# Altium schematic sheet 07 MIMXRT1170 PART3.SchDoc
size A2; ApprovedBy: DNP; CheckedBy: DNP; Author: DNP; CompanyName: Google LLC; DrawnBy: DNP; Organization: Google LLC; Address1: 1600 Amphitheatre Parkway; Address2: Mountain View, CA 94043; Address3: DNP; Address4: DNP; DocumentNumber: 7; SheetNumber: 7; SheetTotal: 17; VersionControl_RevNumber: DNP; IsUserConfigurable: DNP; Time: DNP; ImagePath: DNP; Rule: DNP; ProjectName: Enterprise; Application_BuildNumber: DNP
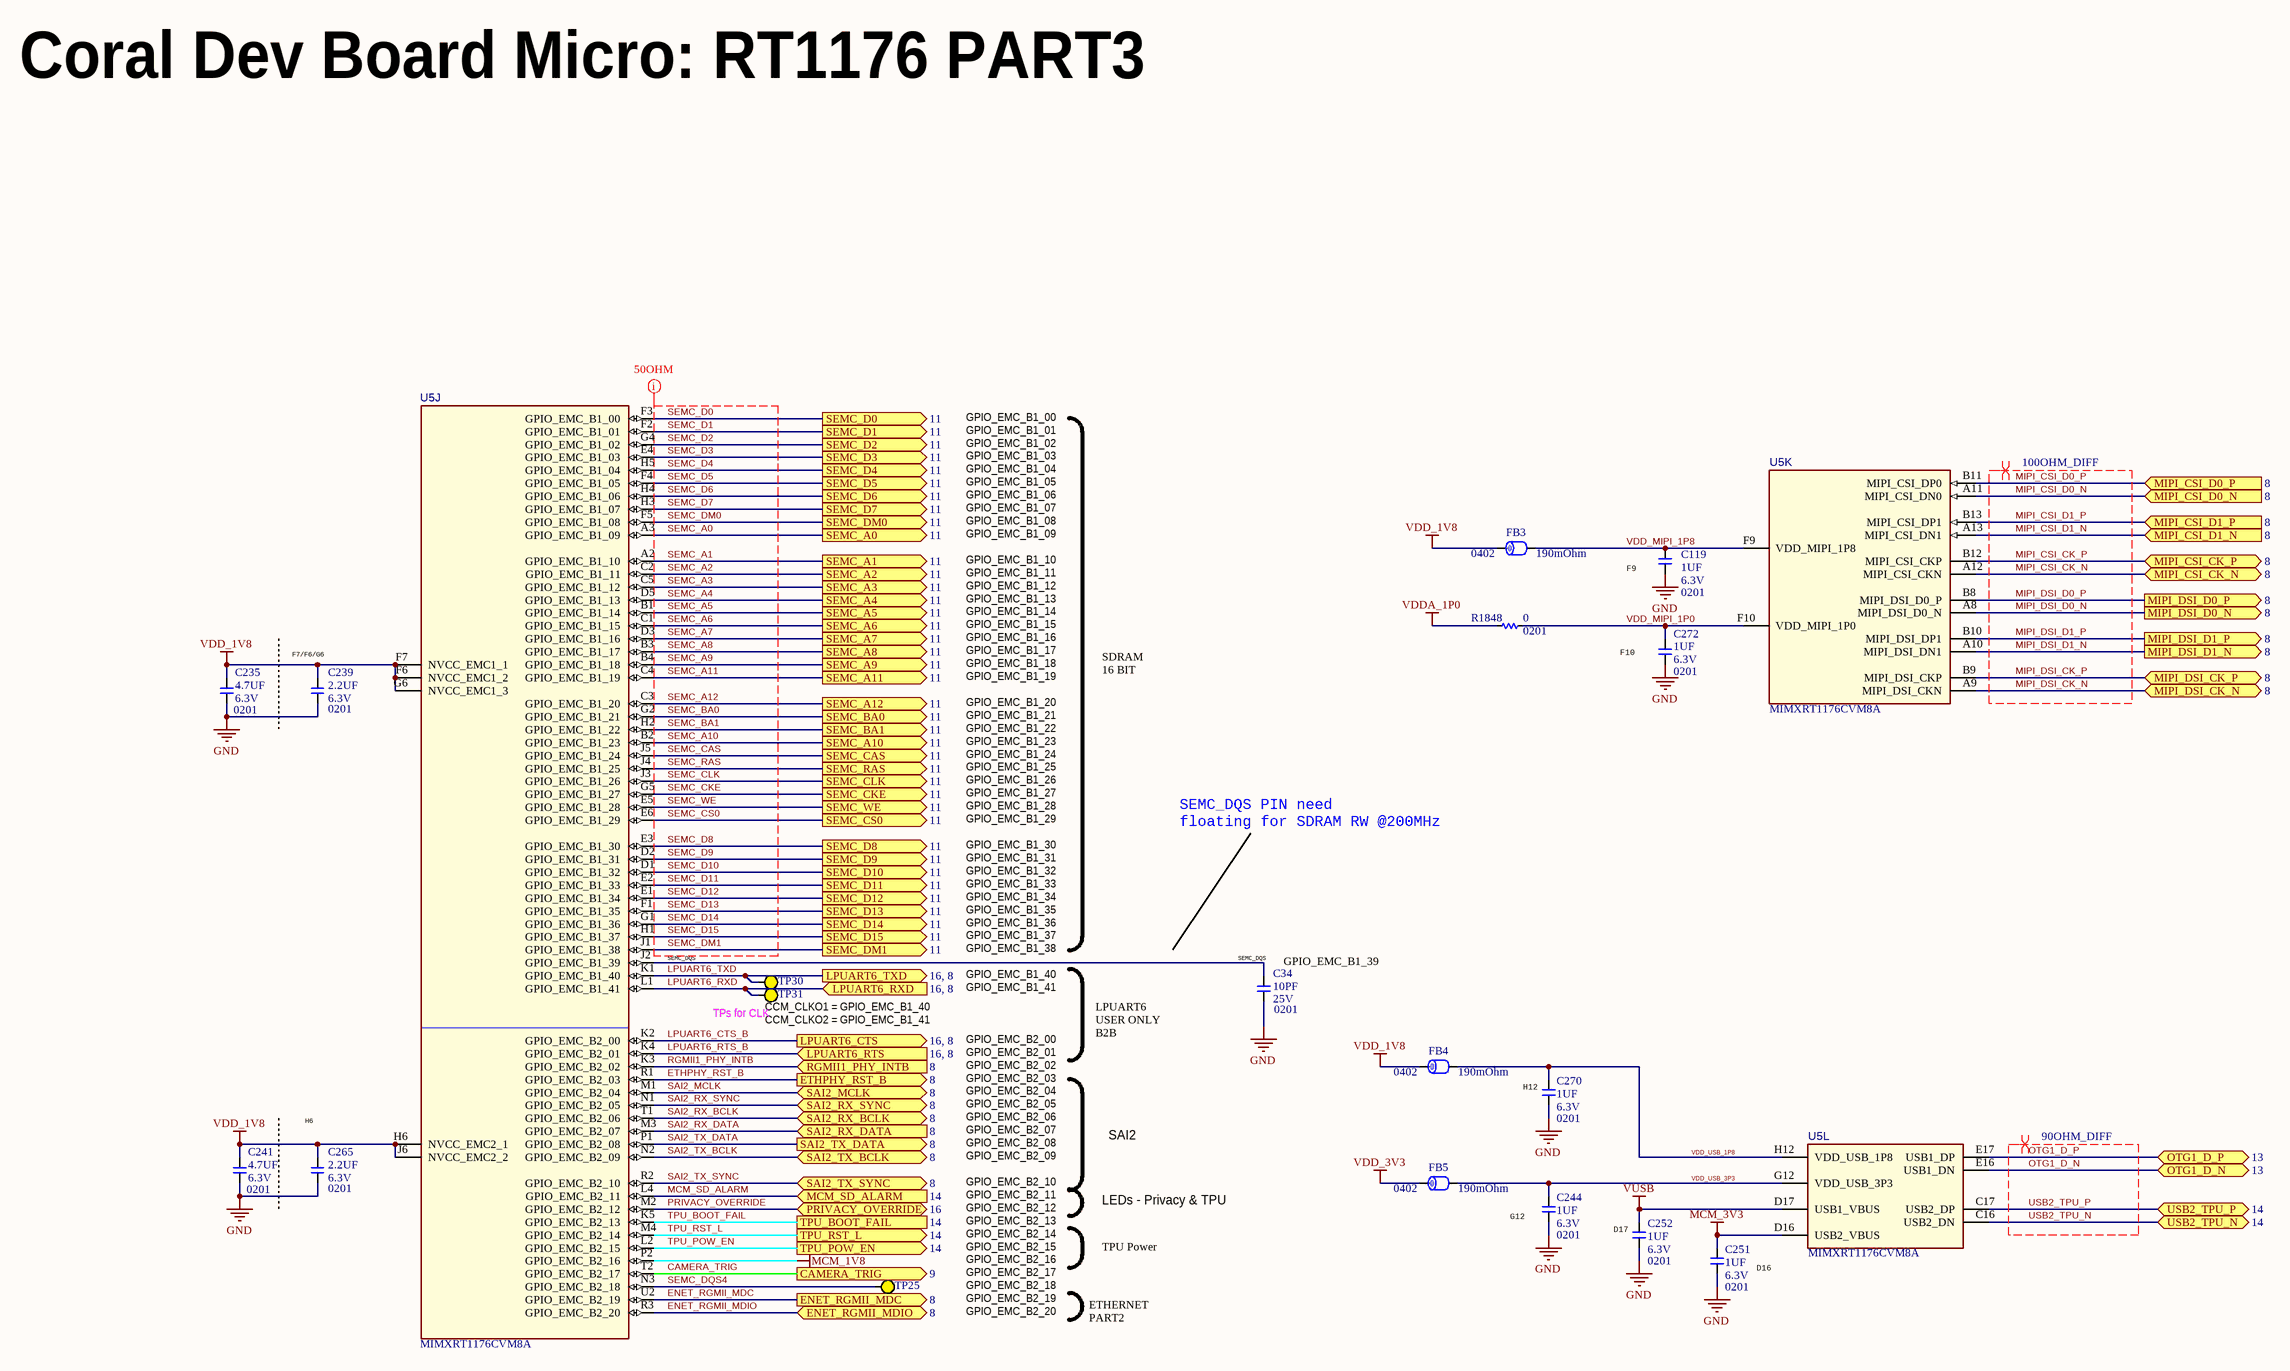
[diagram p0: 07 MIMXRT1170 PART3.SchDoc]

## Parts
C34  value 10PF  Package: 0201  Voltage: 25V  [C0201Y]  (hidden comment: __Template_Cap)
C119  value 1UF  Package: 0201  Voltage: 6.3V  [C0201_H0.39MM]  (hidden comment: __Template_Cap)
C235  value 4.7UF  Package: 0201  Voltage: 6.3V  [C0201Y]  (hidden comment: __Template_Cap)
C239  value 2.2UF  Package: 0201  Voltage: 6.3V  [C0201_H0.39MM]  (hidden comment: __Template_Cap)
C241  value 4.7UF  Package: 0201  Voltage: 6.3V  [C0201Y]  (hidden comment: __Template_Cap)
C244  value 1UF  Package: 0201  Voltage: 6.3V  [C0201_H0.39MM]  (hidden comment: __Template_Cap)
C251  value 1UF  Package: 0201  Voltage: 6.3V  [C0201_H0.39MM]  (hidden comment: __Template_Cap)
C252  value 1UF  Package: 0201  Voltage: 6.3V  [C0201_H0.39MM]  (hidden comment: __Template_Cap)
C265  value 2.2UF  Package: 0201  Voltage: 6.3V  [C0201_H0.39MM]  (hidden comment: __Template_Cap)
C270  value 1UF  Package: 0201  Voltage: 6.3V  [C0201_H0.39MM]  (hidden comment: __Template_Cap)
C272  value 1UF  Package: 0201  Voltage: 6.3V  [C0201_H0.39MM]  (hidden comment: __Template_Cap)
FB3  Package: 0402  Rdc max: 190mOhm  [L0402_H0.55MM]  (hidden comment: __Template_Ferrite_Bead)
FB4  Package: 0402  Rdc max: 190mOhm  [L0402_H0.55MM]  (hidden comment: __Template_Ferrite_Bead)
FB5  Package: 0402  Rdc max: 190mOhm  [L0402_H0.55MM]  (hidden comment: __Template_Ferrite_Bead)
R1848  value 0  Package: 0201  [R0201]
TP25  TESTPAD_30MIL  [TESTPAD_SMT_30MIL]  (value not drawn)  (no BOM)
TP30  TESTPAD_30MIL  [TESTPAD_SMT_30MIL]  (value not drawn)  (no BOM)
TP31  TESTPAD_30MIL  [TESTPAD_SMT_30MIL]  (value not drawn)  (no BOM)
U5  MFG P/N: MIMXRT1176CVM8A  [BGA289C80P17X17_1400X14000X152]  (hidden comment: MCU_MIMXRT1176CVM8A)  (parts J,K,L of 12)

## Ports
CAMERA_TRIG (out, see 9), ENET_RGMII_MDC (out, see 8), ENET_RGMII_MDIO (bidir, see 8), ETHPHY_RST_B (out, see 8), LPUART6_CTS (out, see 16, 8), LPUART6_RTS (in, see 16, 8), LPUART6_RXD (in, see 16, 8), LPUART6_TXD (out, see 16, 8), MCM_SD_ALARM (in, see 14), MIPI_CSI_CK_N (bidir, see 8), MIPI_CSI_CK_P (bidir, see 8), MIPI_CSI_D0_N (in, see 8), MIPI_CSI_D0_P (in, see 8), MIPI_CSI_D1_N (in, see 8), MIPI_CSI_D1_P (in, see 8), MIPI_DSI_CK_N (bidir, see 8), MIPI_DSI_CK_P (bidir, see 8), MIPI_DSI_D0_N (out, see 8), MIPI_DSI_D0_P (out, see 8), MIPI_DSI_D1_N (out, see 8), MIPI_DSI_D1_P (out, see 8), OTG1_D_N (bidir, see 13), OTG1_D_P (bidir, see 13), PRIVACY_OVERRIDE (bidir, see 16), RGMII1_PHY_INTB (in, see 8), SAI2_MCLK (bidir, see 8), SAI2_RX_BCLK (bidir, see 8), SAI2_RX_DATA (in, see 8), SAI2_RX_SYNC (bidir, see 8), SAI2_TX_BCLK (bidir, see 8), SAI2_TX_DATA (out, see 8), SAI2_TX_SYNC (bidir, see 8), SEMC_A0 (out, see 11), SEMC_A1 (out, see 11), SEMC_A2 (out, see 11), SEMC_A3 (out, see 11), SEMC_A4 (out, see 11), SEMC_A5 (out, see 11), SEMC_A6 (out, see 11), SEMC_A7 (out, see 11), SEMC_A8 (out, see 11), SEMC_A9 (out, see 11), SEMC_A10 (out, see 11), SEMC_A11 (out, see 11), SEMC_A12 (out, see 11), SEMC_BA0 (out, see 11), SEMC_BA1 (out, see 11), SEMC_CAS (out, see 11), SEMC_CKE (out, see 11), SEMC_CLK (out, see 11), SEMC_CS0 (out, see 11), SEMC_D0 (out, see 11), SEMC_D1 (out, see 11), SEMC_D2 (out, see 11), SEMC_D3 (out, see 11), SEMC_D4 (out, see 11), SEMC_D5 (out, see 11), SEMC_D6 (out, see 11), SEMC_D7 (out, see 11), SEMC_D8 (out, see 11), SEMC_D9 (out, see 11), SEMC_D10 (out, see 11), SEMC_D11 (out, see 11), SEMC_D12 (out, see 11), SEMC_D13 (out, see 11), SEMC_D14 (out, see 11), SEMC_D15 (out, see 11), SEMC_DM0 (out, see 11), SEMC_DM1 (out, see 11), SEMC_RAS (out, see 11), SEMC_WE (out, see 11), TPU_BOOT_FAIL (see 14), TPU_POW_EN (out, see 14), TPU_RST_L (out, see 14), USB2_TPU_N (bidir, see 14), USB2_TPU_P (bidir, see 14)

## Nets
GND: C34.2 C119.2 C235.2 C239.2 C241.2 C244.2 C251.2 C252.2 C265.2 C270.2 C272.2
MCM_1V8: U5.P2(GPIO_EMC_B2_16)
MCM_3V3: C251.1 U5.D16(USB2_VBUS)
VDD_1V8: C235.1 C239.1 C241.1 C265.1 FB3.1 FB4.1 U5.F6(NVCC_EMC1_2) U5.F7(NVCC_EMC1_1) U5.G6(NVCC_EMC1_3) U5.H6(NVCC_EMC2_1) U5.J6(NVCC_EMC2_2)
VDD_3V3: FB5.1
VDDA_1P0: R1848.1
VUSB: C252.1 U5.D17(USB1_VBUS)
CAMERA_TRIG: U5.T2(GPIO_EMC_B2_17) ; port CAMERA_TRIG
ENET_RGMII_MDC: U5.U2(GPIO_EMC_B2_19) ; port ENET_RGMII_MDC
ENET_RGMII_MDIO: U5.R3(GPIO_EMC_B2_20) ; port ENET_RGMII_MDIO
ETHPHY_RST_B: U5.R1(GPIO_EMC_B2_03) ; port ETHPHY_RST_B
LPUART6_CTS_B: U5.K2(GPIO_EMC_B2_00) ; port LPUART6_CTS
LPUART6_RTS_B: U5.K4(GPIO_EMC_B2_01) ; port LPUART6_RTS
LPUART6_RXD: TP31.1 U5.L1(GPIO_EMC_B1_41) ; port LPUART6_RXD
LPUART6_TXD: TP30.1 U5.K1(GPIO_EMC_B1_40) ; port LPUART6_TXD
MCM_SD_ALARM: U5.L4(GPIO_EMC_B2_11) ; port MCM_SD_ALARM
MIPI_CSI_CK_N: U5.A12(MIPI_CSI_CKN) ; port MIPI_CSI_CK_N
MIPI_CSI_CK_P: U5.B12(MIPI_CSI_CKP) ; port MIPI_CSI_CK_P
MIPI_CSI_D0_N: U5.A11(MIPI_CSI_DN0) ; port MIPI_CSI_D0_N
MIPI_CSI_D0_P: U5.B11(MIPI_CSI_DP0) ; port MIPI_CSI_D0_P
MIPI_CSI_D1_N: U5.A13(MIPI_CSI_DN1) ; port MIPI_CSI_D1_N
MIPI_CSI_D1_P: U5.B13(MIPI_CSI_DP1) ; port MIPI_CSI_D1_P
MIPI_DSI_CK_N: U5.A9(MIPI_DSI_CKN) ; port MIPI_DSI_CK_N
MIPI_DSI_CK_P: U5.B9(MIPI_DSI_CKP) ; port MIPI_DSI_CK_P
MIPI_DSI_D0_N: U5.A8(MIPI_DSI_D0_N) ; port MIPI_DSI_D0_N
MIPI_DSI_D0_P: U5.B8(MIPI_DSI_D0_P) ; port MIPI_DSI_D0_P
MIPI_DSI_D1_N: U5.A10(MIPI_DSI_DN1) ; port MIPI_DSI_D1_N
MIPI_DSI_D1_P: U5.B10(MIPI_DSI_DP1) ; port MIPI_DSI_D1_P
OTG1_D_N: U5.E16(USB1_DN) ; port OTG1_D_N
OTG1_D_P: U5.E17(USB1_DP) ; port OTG1_D_P
PRIVACY_OVERRIDE: U5.M2(GPIO_EMC_B2_12) ; port PRIVACY_OVERRIDE
RGMII1_PHY_INTB: U5.K3(GPIO_EMC_B2_02) ; port RGMII1_PHY_INTB
SAI2_MCLK: U5.M1(GPIO_EMC_B2_04) ; port SAI2_MCLK
SAI2_RX_BCLK: U5.T1(GPIO_EMC_B2_06) ; port SAI2_RX_BCLK
SAI2_RX_DATA: U5.M3(GPIO_EMC_B2_07) ; port SAI2_RX_DATA
SAI2_RX_SYNC: U5.N1(GPIO_EMC_B2_05) ; port SAI2_RX_SYNC
SAI2_TX_BCLK: U5.N2(GPIO_EMC_B2_09) ; port SAI2_TX_BCLK
SAI2_TX_DATA: U5.P1(GPIO_EMC_B2_08) ; port SAI2_TX_DATA
SAI2_TX_SYNC: U5.R2(GPIO_EMC_B2_10) ; port SAI2_TX_SYNC
SEMC_A0: U5.A3(GPIO_EMC_B1_09) ; port SEMC_A0
SEMC_A1: U5.A2(GPIO_EMC_B1_10) ; port SEMC_A1
SEMC_A2: U5.C2(GPIO_EMC_B1_11) ; port SEMC_A2
SEMC_A3: U5.C5(GPIO_EMC_B1_12) ; port SEMC_A3
SEMC_A4: U5.D5(GPIO_EMC_B1_13) ; port SEMC_A4
SEMC_A5: U5.B1(GPIO_EMC_B1_14) ; port SEMC_A5
SEMC_A6: U5.C1(GPIO_EMC_B1_15) ; port SEMC_A6
SEMC_A7: U5.D3(GPIO_EMC_B1_16) ; port SEMC_A7
SEMC_A8: U5.B3(GPIO_EMC_B1_17) ; port SEMC_A8
SEMC_A9: U5.B4(GPIO_EMC_B1_18) ; port SEMC_A9
SEMC_A10: U5.B2(GPIO_EMC_B1_23) ; port SEMC_A10
SEMC_A11: U5.C4(GPIO_EMC_B1_19) ; port SEMC_A11
SEMC_A12: U5.C3(GPIO_EMC_B1_20) ; port SEMC_A12
SEMC_BA0: U5.G2(GPIO_EMC_B1_21) ; port SEMC_BA0
SEMC_BA1: U5.H2(GPIO_EMC_B1_22) ; port SEMC_BA1
SEMC_CAS: U5.J5(GPIO_EMC_B1_24) ; port SEMC_CAS
SEMC_CKE: U5.G5(GPIO_EMC_B1_27) ; port SEMC_CKE
SEMC_CLK: U5.J3(GPIO_EMC_B1_26) ; port SEMC_CLK
SEMC_CS0: U5.E6(GPIO_EMC_B1_29) ; port SEMC_CS0
SEMC_D0: U5.F3(GPIO_EMC_B1_00) ; port SEMC_D0
SEMC_D1: U5.F2(GPIO_EMC_B1_01) ; port SEMC_D1
SEMC_D2: U5.G4(GPIO_EMC_B1_02) ; port SEMC_D2
SEMC_D3: U5.E4(GPIO_EMC_B1_03) ; port SEMC_D3
SEMC_D4: U5.H5(GPIO_EMC_B1_04) ; port SEMC_D4
SEMC_D5: U5.F4(GPIO_EMC_B1_05) ; port SEMC_D5
SEMC_D6: U5.H4(GPIO_EMC_B1_06) ; port SEMC_D6
SEMC_D7: U5.H3(GPIO_EMC_B1_07) ; port SEMC_D7
SEMC_D8: U5.E3(GPIO_EMC_B1_30) ; port SEMC_D8
SEMC_D9: U5.D2(GPIO_EMC_B1_31) ; port SEMC_D9
SEMC_D10: U5.D1(GPIO_EMC_B1_32) ; port SEMC_D10
SEMC_D11: U5.E2(GPIO_EMC_B1_33) ; port SEMC_D11
SEMC_D12: U5.E1(GPIO_EMC_B1_34) ; port SEMC_D12
SEMC_D13: U5.F1(GPIO_EMC_B1_35) ; port SEMC_D13
SEMC_D14: U5.G1(GPIO_EMC_B1_36) ; port SEMC_D14
SEMC_D15: U5.H1(GPIO_EMC_B1_37) ; port SEMC_D15
SEMC_DM0: U5.F5(GPIO_EMC_B1_08) ; port SEMC_DM0
SEMC_DM1: U5.J1(GPIO_EMC_B1_38) ; port SEMC_DM1
SEMC_DQS4: TP25.1 U5.N3(GPIO_EMC_B2_18)
SEMC_RAS: U5.J4(GPIO_EMC_B1_25) ; port SEMC_RAS
SEMC_WE: U5.E5(GPIO_EMC_B1_28) ; port SEMC_WE
TPU_BOOT_FAIL: U5.K5(GPIO_EMC_B2_13) ; port TPU_BOOT_FAIL
TPU_POW_EN: U5.L2(GPIO_EMC_B2_15) ; port TPU_POW_EN
TPU_RST_L: U5.M4(GPIO_EMC_B2_14) ; port TPU_RST_L
USB2_TPU_N: U5.C16(USB2_DN) ; port USB2_TPU_N
USB2_TPU_P: U5.C17(USB2_DP) ; port USB2_TPU_P
VDD_MIPI_1P0: C272.1 R1848.2 U5.F10(VDD_MIPI_1P0)
VDD_MIPI_1P8: C119.1 FB3.2 U5.F9(VDD_MIPI_1P8)
VDD_USB_1P8: C270.1 FB4.2 U5.H12(VDD_USB_1P8)
VDD_USB_3P3: C244.1 FB5.2 U5.G12(VDD_USB_3P3)
NetC34_1: C34.1 U5.J2(GPIO_EMC_B1_39)

## Layout directives
differential pair; differential pair class 100OHM_DIFF: MIPI_CSI_CK_N, MIPI_CSI_CK_P, MIPI_CSI_D0_N, MIPI_CSI_D0_P, MIPI_CSI_D1_N, MIPI_CSI_D1_P, MIPI_DSI_CK_N, MIPI_DSI_CK_P, MIPI_DSI_D0_N, MIPI_DSI_D0_P, MIPI_DSI_D1_N, MIPI_DSI_D1_P
differential pair; differential pair class 90OHM_DIFF: OTG1_D_N, OTG1_D_P, USB2_TPU_N, USB2_TPU_P
net class 50OHM: SEMC_A0, SEMC_A1, SEMC_A2, SEMC_A3, SEMC_A4, SEMC_A5, SEMC_A6, SEMC_A7, SEMC_A8, SEMC_A9, SEMC_A10, SEMC_A11, SEMC_A12, SEMC_BA0, SEMC_BA1, SEMC_CAS, SEMC_CKE, SEMC_CLK, SEMC_CS0, SEMC_D0, SEMC_D1, SEMC_D2, SEMC_D3, SEMC_D4, SEMC_D5, SEMC_D6, SEMC_D7, SEMC_D8, SEMC_D9, SEMC_D10, SEMC_D11, SEMC_D12, SEMC_D13, SEMC_D14, SEMC_D15, SEMC_DM0, SEMC_DM1, SEMC_RAS, SEMC_WE

## Notes on the sheet
- Coral Dev Board Micro: RT1176 PART3
- GPIO_EMC_B1_00
- GPIO_EMC_B1_01
- GPIO_EMC_B1_02
- GPIO_EMC_B1_03
- GPIO_EMC_B1_04
- GPIO_EMC_B1_05
- GPIO_EMC_B1_06
- GPIO_EMC_B1_07
- GPIO_EMC_B1_08
- GPIO_EMC_B1_09
- GPIO_EMC_B1_10
- GPIO_EMC_B1_11
- GPIO_EMC_B1_12
- GPIO_EMC_B1_13
- GPIO_EMC_B1_14
- (near C119) F9
- (near C239) F7/F6/G6
- GPIO_EMC_B1_15
- GPIO_EMC_B1_16
- GPIO_EMC_B1_17
- GPIO_EMC_B1_18
- GPIO_EMC_B1_19
- SDRAM
- 16 BIT
- (near C272) F10
- GPIO_EMC_B1_20
- GPIO_EMC_B1_21
- GPIO_EMC_B1_22
- GPIO_EMC_B1_23
- GPIO_EMC_B1_24
- GPIO_EMC_B1_25
- GPIO_EMC_B1_26
- GPIO_EMC_B1_27
- GPIO_EMC_B1_28
- GPIO_EMC_B1_29
- GPIO_EMC_B1_30
- GPIO_EMC_B1_31
- GPIO_EMC_B1_32
- SEMC_DQS PIN need
  floating for SDRAM RW @200MHz
- GPIO_EMC_B1_33
- GPIO_EMC_B1_34
- GPIO_EMC_B1_35
- GPIO_EMC_B1_36
- GPIO_EMC_B1_37
- GPIO_EMC_B1_38
- (near U5) SEMC_DQS
- (near TP31) CCM_CLKO1 = GPIO_EMC_B1_40
- GPIO_EMC_B1_40
- GPIO_EMC_B1_41
- LPUART6
- (near C34) SEMC_DQS
- (near C34) GPIO_EMC_B1_39
- (near TP31) TPs for CLK
- CCM_CLKO2 = GPIO_EMC_B1_41
- GPIO_EMC_B2_00
- GPIO_EMC_B2_01
- GPIO_EMC_B2_02
- GPIO_EMC_B2_03
- USER ONLY
- B2B
- (near C265) H6
- GPIO_EMC_B2_04
- GPIO_EMC_B2_05
- GPIO_EMC_B2_06
- GPIO_EMC_B2_07
- SAI2
- (near C270) H12
- GPIO_EMC_B2_08
- GPIO_EMC_B2_09
- GPIO_EMC_B2_10
- GPIO_EMC_B2_12
- GPIO_EMC_B2_11
- LEDs - Privacy & TPU
- GPIO_EMC_B2_14
- GPIO_EMC_B2_15
- GPIO_EMC_B2_16
- GPIO_EMC_B2_13
- TPU Power
- (near C244) G12
- (near C252) D17
- D16
- GPIO_EMC_B2_18
- GPIO_EMC_B2_19
- GPIO_EMC_B2_20
- GPIO_EMC_B2_17
- ETHERNET
- PART2
- Project:
- Engineer:
- Date:
- File:
- Revision:
- Sheet
- of

## Library data of the parts
C34 = 614: CAP, CER, NP0, 10pF, 25V, 5%, 0201, 0.33mm T; ID: 614; MFG: MURATA; MFG P/N: OBS: GRM0335C1E100JD01D; XPN: 150-00028-00; EPIC: G150-00028-00; Status: Released; Dielectric: NP0; Tolerance: 5%; Height: 0.33mm T; ComponentLink1Description: Datasheet; COMMON: 150-00028-00; LOON: 150-00028-00; Gecko: 150-00028-00
C119 C244 C251 C252 C270 C272 = 1771: CAP, CER, X6S, 1uF, 20%, 6.3V, 0201, 0.39mm; ID: 1771; MFG: MURATA; MFG P/N: GRM033C80J105ME05D; EPIC: G150-02531-00; Status: In Development; Dielectric: X6S; Tolerance: 20%; Height: 0.39mm; Supplier 1: Digi-Key; HelpURL: https://www.digikey.com/product-detail/en/murata-electronics-north-america/GRM033C80J105ME05D/490-13218-1-ND/5877426; ComponentLink1Description: Datasheet; ComponentLink1URL: https://psearch.en.murata.com/capacitor/product/GRM033C80J105ME05%23.pdf; Supplier Part Number 1: 490-13218-1-ND
C235 C241 = 1199: CAP, CER, X5R, 4.7uF, 20%, 6.3V, 0201; ID: 1199; MFG: MURATA; MFG P/N: GRM035R60J475ME15D; XPN: 150-01224-00; PROXY: 150-03477-00; Status: Released; Dielectric: X5R; Tolerance: 20%; Height: 0.33mm T; ComponentLink1Description: Datasheet; COMMON: 150-01224-00; LOON: 150-01224-00; Gecko: 150-01224-00
C239 C265 = 1761: CAP, CER, X5R, 2.2uF, 20%, 6.3V, 0201, 0.39mm; ID: 1761; MFG: YAGEO; MFG P/N: CC0201MRX5R5BB225; EPIC: G150-01316-00; Status: In Development; Dielectric: X5R; Tolerance: 20%; Height: 0.39mm; Supplier 1: Digi-Key; HelpURL: https://www.digikey.com/product-detail/en/yageo/CC0201MRX5R5BB225/311-3473-1-ND/7164494; ComponentLink1Description: Datasheet; ComponentLink1URL: http://www.yageo.com/documents/recent/UPY-GPHC_X5R_4V-to-50V_25.pdf; Supplier Part Number 1: 311-3473-1-ND
FB3-FB5 = 913: FERRITE, BEAD, 120 OHMS@100MHZ, 25%, 550mA, 190 mOHM DCR, 0402; ID: 913; Catagory: Ferrite Bead; MFG: Murata Electronics; MFG P/N: BLM15AG121SN1D; ComponentLink1Description: Datasheet; Status: Released; Idc max: 550mA; Supplier 1: Digi-Key; HelpURL: https://www.digikey.com/product-detail/en/murata-electronics/BLM15AG121SN1D/490-1005-1-ND/584453; ComponentLink1URL: https://www.murata.com/en-us/products/productdata/8796740059166/ENFA0018.pdf; Height: 0.55mm; Supplier Part Number 1: 490-1005-1-ND
R1848 = 8315: RES, 0.0, 1/20W, 0201; ID: 8315; MFG: PANASONIC; MFG P/N: ERJ1GN0R00C; Tolerance: JUMPER; COMMON: 470-00013-00; PROXY: Use ID #6940; Status: Released; Power: 1/20W; LOON: 470-00013-00; Gecko: 470-00013-00; XPN: 470-00013-00
TP25 TP30 TP31 = 178: TESTPAD_SMT_30MIL; ID: 178; MFG: _PCB Feature; Status: Released; ComponentLink1URL: _PCB Feature
U5 = 117: IC, PROCESSOR, MIMXRT1176CV, ARM CORTEX-M4/M7, 2MB RAM, SDRAM, WLAN, BGA-289; ID: 117; MFG: NXP Semiconductors; Status: Released; Package: BGA-289; Category: Integrated Circuits (ICs); RoHS Compliant: Yes; ComponentLink1Description: Datasheet; ComponentLink1URL: https://drive.google.com/file/d/1FTzS3WjHycHWpbzAg-R_xAViv5bKJdqv/view; Height: 1.52mm